# EAGLE design PillEndo-Proto_LED (EAGLE 6.5.0)
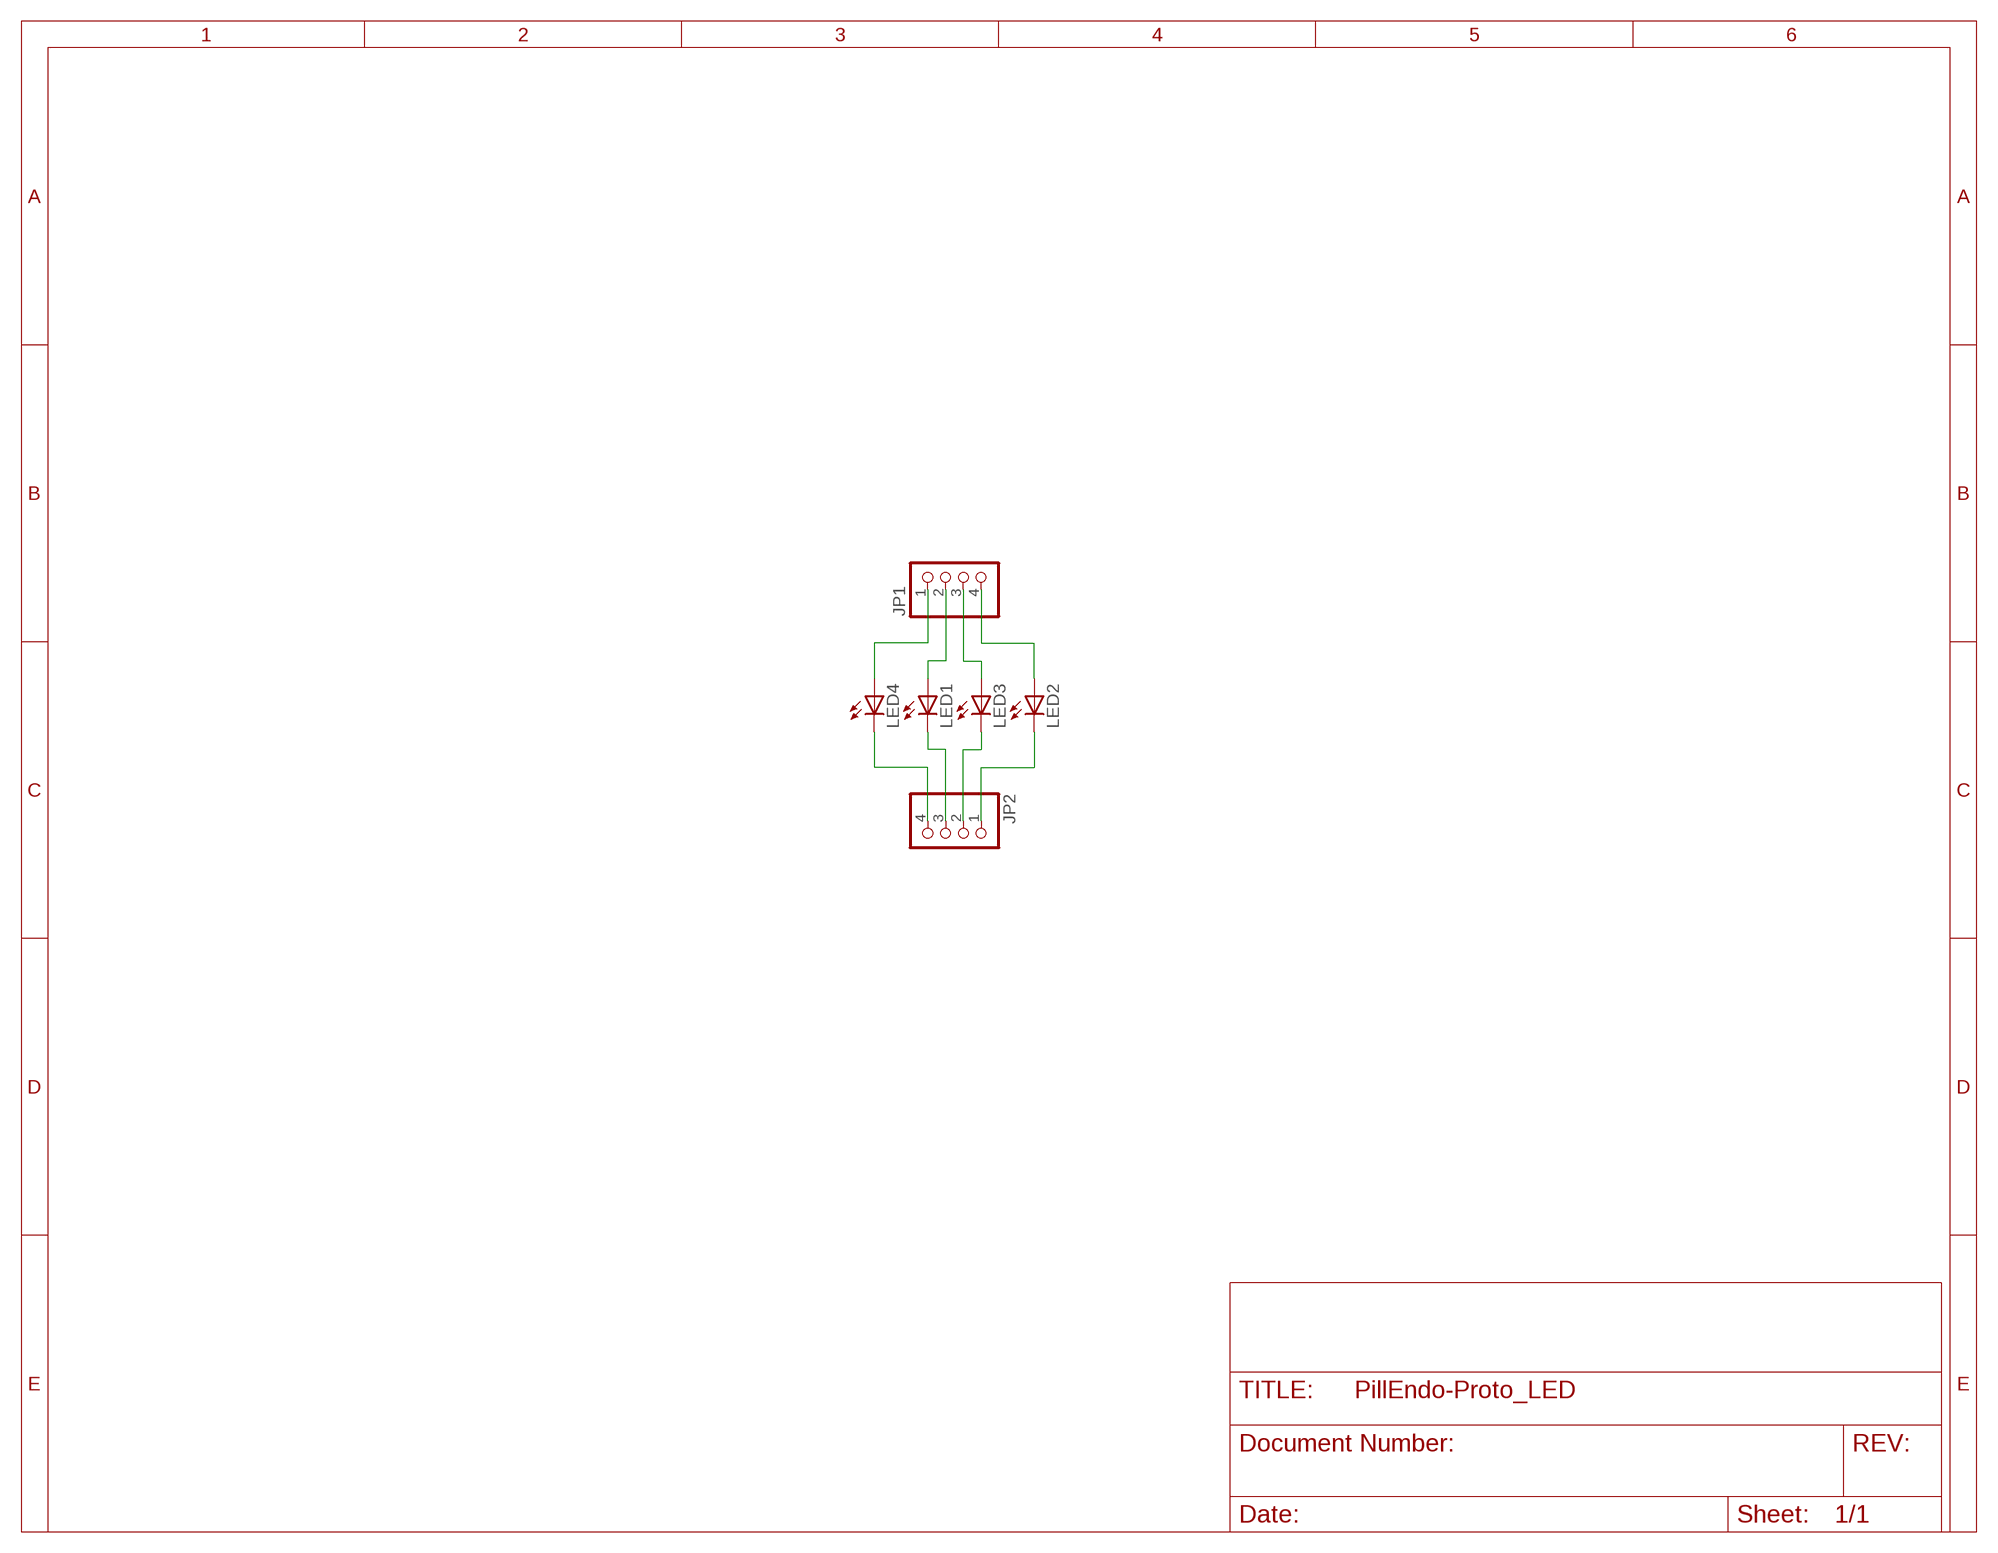
[diagram p0: schematic, sheet 1]

## Parts
JP1  PINHD-1X4  [1X04]
JP2  PINHD-1X4  [1X04]
LED1  LED  [SMARTLED-TTW]
LED2  LED  [SMARTLED-TTW]
LED3  LED  [SMARTLED-TTW]
LED4  LED  [SMARTLED-TTW]

## Nets
N$1: JP2.2 LED3.C@1(C)
N$2: JP2.3 LED1.C@1(C)
N$3: JP2.1 LED2.C@1(C)
N$4: JP2.4 LED4.C@1(C)
N$5: JP1.3 LED3.A@1(A)
N$6: JP1.2 LED1.A@1(A)
N$7: JP1.1 LED4.A@1(A)
N$8: JP1.4 LED2.A@1(A)

## Library data of the parts
JP1 JP2 = pinhead:PINHD-1X4: PIN HEADER
LED1-LED4 = adafruit:LED: LED OSRAM: - CHIPLED LG R971, LG N971, LY N971, LG Q971, LY Q971, LO R971, LY R971 LH N974, LH R974 LS Q976, LO Q976, LY Q976 LO Q996 - Hyper CHIPLED LW Q18S LB Q993, LB Q99A, LB R99A - SideLED LS A670, LO A670, LY A670, LG A670, LP A670 LB A673, LV A673, LT A673, LW A673 LH A674 LY A675 LS A676, LA A676, LO A676, LY A676, LW A676 LS A679, LY A679, LG A679 - Hyper Micro SIDELED® LS Y876, LA Y876, LO Y876, LY Y876 LT Y87S - SmartLED LW L88C, LW L88S LB L89C, LB L89S, LG L890 LS L89K, LO L89K, LY L89K LS L896, LA L896, LO L896, LY L896 - TOPLED LS T670, LO T670, LY T670, LG T670, LP T670 LSG T670, LSP T670, LSY T670, LOP T670, LYG T670 LG T671, LOG T671, LSG T671 LB T673, LV T673, LT T673, LW T673 LH T674 LS T676, LA T676, LO T676, LY T676, LB T676, LH T676, LSB T676, LW T676 LB T67C, LV T67C, LT T67C, LS T67K, LO T67K, LY T67K, LW E67C LS E67B, LA E67B, LO E67B, LY E67B, LB E67C, LV E67C, LT E67C LW T67C LS T679, LY T679, LG T679 LS T770, LO T770, LY T770, LG T770, LP T770 LB T773, LV T773, LT T773, LW T773 LH T774 LS E675, LA E675, LY E675, LS T675 LS T776, LA T776, LO T776, LY T776, LB T776 LHGB T686 LT T68C, LB T68C - Hyper Mini TOPLED® LB M676 - Mini TOPLED Santana® LG M470 LS M47K, LO M47K, LY M47K Source: http://www.osram.convergy.de/

## Board
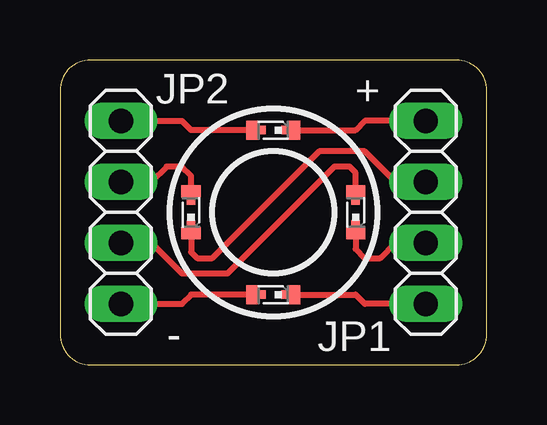
[diagram p1: board, top side]

Size 17.78 x 12.7 mm. Coordinates in mm from the lower left corner, seen from the top.
Outline: 1.27,0 16.51,0 arc90 17.78,1.27 17.78,11.43 arc90 16.51,12.7 1.27,12.7 arc90 0,11.43 0,1.27 arc90 1.27,0
Copper layers (1*16): Top 0.0356mm / dielectric 1.5011mm / Bottom 0.0356mm
Design rules "LaenPCBOrder": minimum track width 6mil, minimum drill 13mil, track to track 6mil, track to pad 6mil, pad to pad 6mil, via to via 6mil, smd to smd 6mil, copper to edge 15mil, drill to drill 6mil, minimum pad ring 7mil, minimum via ring 7mil, stop-mask expansion 3mil, vias tented up to drill 0mil, thermal gap 10mil

### Footprints (pad centres in the part's own frame; a part is rotated, then mirrored left to right if it is on the bottom)
1X04 = drill 1.016 long: 1 -3.81,0; 2 -1.27,0; 3 1.27,0; 4 3.81,0
SMARTLED-TTW = smd 0.8 x 0.5: A 0,-0.875; C 0,0.875 | smd 0.35 x 0.35: A@1 0,-0.5; C@1 0,0.5

### Placement (x,y rotation side)
JP1  15.24,6.35 90 top
JP2  2.54,6.35 270 top
LED1  12.32,6.35 0 top
LED2  8.89,9.78 90 top
LED3  5.46,6.35 0 top
LED4  8.89,2.92 90 top

### Tracks (layer width: path | path; a pad name or v marks a point on that pad's centre or on a via)
N$1
  Top 0.254: LED3.C@1 5.46,7.87 5.08,8.26 4.45,8.26 3.81,7.62 JP2.2
N$2
  Top 0.254: JP2.3 3.81,5.08 5.08,3.81 6.99,3.81 11.43,8.26 12.06,8.26 12.32,8 LED1.C@1
N$3
  Top 0.254: JP2.1 5.08,10.16 5.46,9.78 LED2.C@1
N$4
  Top 0.254: JP2.4 5.08,2.54 5.46,2.92 LED4.C@1
N$5
  Top 0.254: JP1.3 13.97,7.62 12.7,8.89 10.79,8.89 6.35,4.45 5.71,4.45 5.46,4.7 LED3.A@1
N$6
  Top 0.254: LED1.A@1 12.32,4.83 12.7,4.45 13.34,4.45 13.97,5.08 JP1.2
N$7
  Top 0.254: JP1.1 12.7,2.54 12.32,2.92 LED4.A@1
N$8
  Top 0.254: JP1.4 12.7,10.16 12.32,9.78 LED2.A@1

### Text on the board
tPlace: + | -